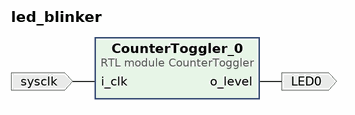
[diagram p0: block diagram of the top level]
# Vivado block design led_blinker, xc7z020clg400-1, Vivado 2021.1
create_bd_design led_blinker

create_bd_port -dir I -type clk sysclk
create_bd_port -dir O LED0

create_bd_cell -type module -reference CounterToggler CounterToggler_0
set_property -dict {CONFIG.COUNTER_VALUE 125000000} [get_bd_cells CounterToggler_0]

# ---- connections ----

connect_bd_net [get_bd_pins CounterToggler_0/o_level] [get_bd_ports LED0]
connect_bd_net -net i_clk_0_1 [get_bd_ports sysclk] [get_bd_pins CounterToggler_0/i_clk]

validate_bd_design
save_bd_design
